# Altium schematic sheet Interface.SchDoc
size A4
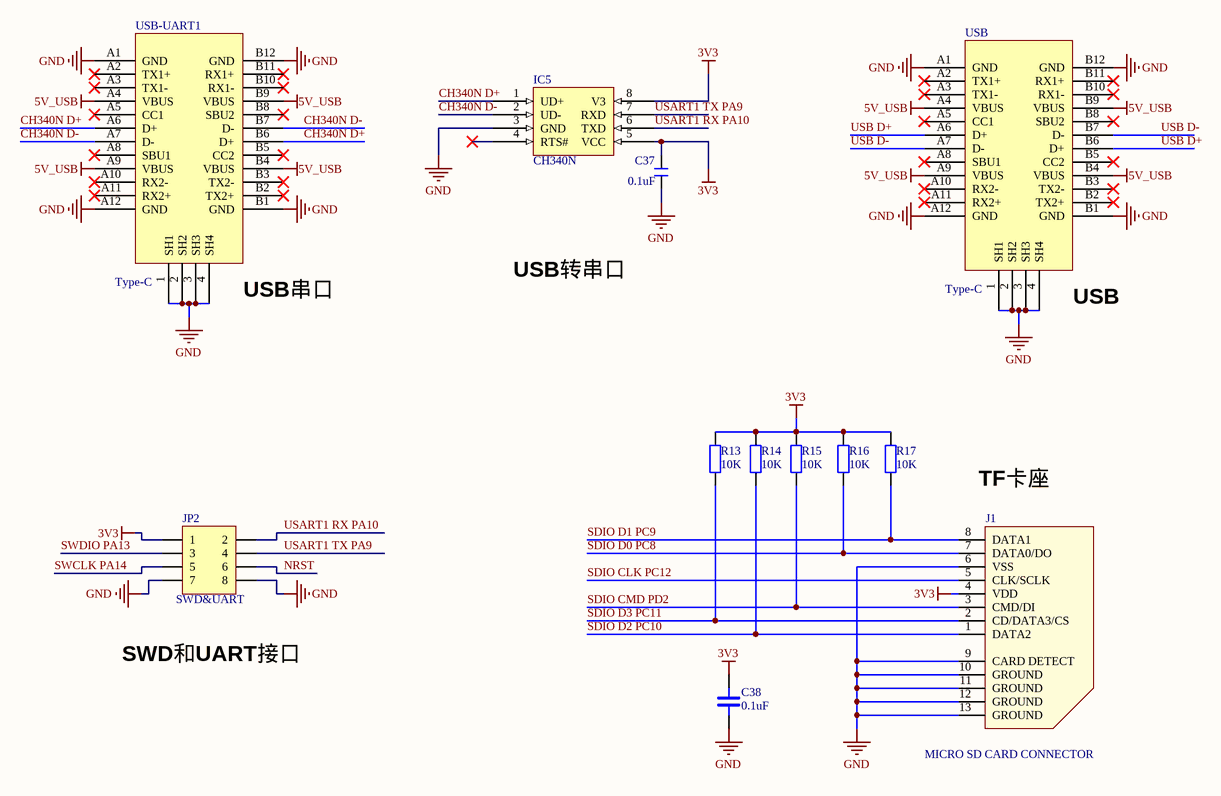
[diagram p0: Interface.SchDoc]

## Parts
C37  0.1uF  [C 0603_M]
C38  0.1uF  [C 0603_M]
IC5  CH340N  [SOP8_M]
J1  MICRO SD CARD CONNECTOR  [Micro SD]
JP2  SWD&UART  [HDR2.54-LI-2x4P]
R13  10K  [R 0603_M]
R14  10K  [R 0603_M]
R15  10K  [R 0603_M]
R16  10K  [R 0603_M]
R17  10K  [R 0603_M]
USB  Type-C  [Type-C]
USB-UART1  Type-C  [Type-C]

## Nets
3V3: C37.2 C38.1 IC5.5(VCC) IC5.8(V3) J1.4(VDD) JP2.1 R13.1 R14.1 R15.1 R16.1 R17.1
5V_USB: USB.A4(VBUS) USB.A9(VBUS) USB.B4(VBUS) USB.B9(VBUS) USB-UART1.A4(VBUS) USB-UART1.A9(VBUS) USB-UART1.B4(VBUS) USB-UART1.B9(VBUS)
GND: C37.1 C38.2 IC5.3(GND) J1.6(VSS) J1.9(CARD_DETECT) J1.10(GROUND) J1.11(GROUND) J1.12(GROUND) J1.13(GROUND) JP2.7 JP2.8 USB.1(SH1) USB.2(SH2) USB.3(SH3) USB.4(SH4) USB.A1(GND) USB.A12(GND) USB.B1(GND) USB.B12(GND) USB-UART1.1(SH1) USB-UART1.2(SH2) USB-UART1.3(SH3) USB-UART1.4(SH4) USB-UART1.A1(GND) USB-UART1.A12(GND) USB-UART1.B1(GND) USB-UART1.B12(GND)
CH340N D+: IC5.1(UD+) USB-UART1.A6(D+) USB-UART1.B6(D+)
CH340N D-: IC5.2(UD-) USB-UART1.A7(D-) USB-UART1.B7(D-)
NRST: JP2.6
SDIO CLK PC12: J1.5(CLK/SCLK)
SDIO CMD PD2: J1.3(CMD/DI) R15.2
SDIO D0 PC8: J1.7(DATA0/DO) R16.2
SDIO D1 PC9: J1.8(DATA1) R17.2
SDIO D2 PC10: J1.1(DATA2) R14.2
SDIO D3 PC11: J1.2(CD/DATA3/CS) R13.2
SWCLK PA14: JP2.5
SWDIO PA13: JP2.3
USART1 RX PA10: IC5.6(TXD) JP2.2
USART1 TX PA9: IC5.7(RXD) JP2.4
USB D+: USB.A6(D+) USB.B6(D+)
USB D-: USB.A7(D-) USB.B7(D-)

Not connected (* = marked no-connect by the designer): IC5 4(RTS#)*; USB A2(TX1+)* A3(TX1-)* A5(CC1)* A8(SBU1)* A10(RX2-)* A11(RX2+)* B2(TX2+)* B3(TX2-)* B5(CC2)* B8(SBU2)* B10(RX1-)* B11(RX1+)*; USB-UART1 A2(TX1+)* A3(TX1-)* A5(CC1)* A8(SBU1)* A10(RX2-)* A11(RX2+)* B2(TX2+)* B3(TX2-)* B5(CC2)* B8(SBU2)* B10(RX1-)* B11(RX1+)*

## Notes on the sheet
- (near USB-UART1) USB串口
- USB转串口
- (near USB) USB
- (near J1) TF卡座
- SWD和UART接口
- Title:
- A4
- Name:
- Date:
- Author@
- firestaradmin

## Library data of the parts
C37 = C: 无极性贴片电容; 版权归属: 源创客; BOM名称: 无极性贴片电容; 学习资源: www.ooocke.com
C38 = CAP: Capacitor
IC5 = CH340N: USB 转串口芯片 CH330/CH340N
JP2 = Header 4X2: 4*2P接插件; 版权归属: 源创客; BOM名称: 4*2P接插件; 学习资源: www.ooocke.com
R13-R17 = RES: Resistor